# EAGLE board buscard (EAGLE 7.6.0)
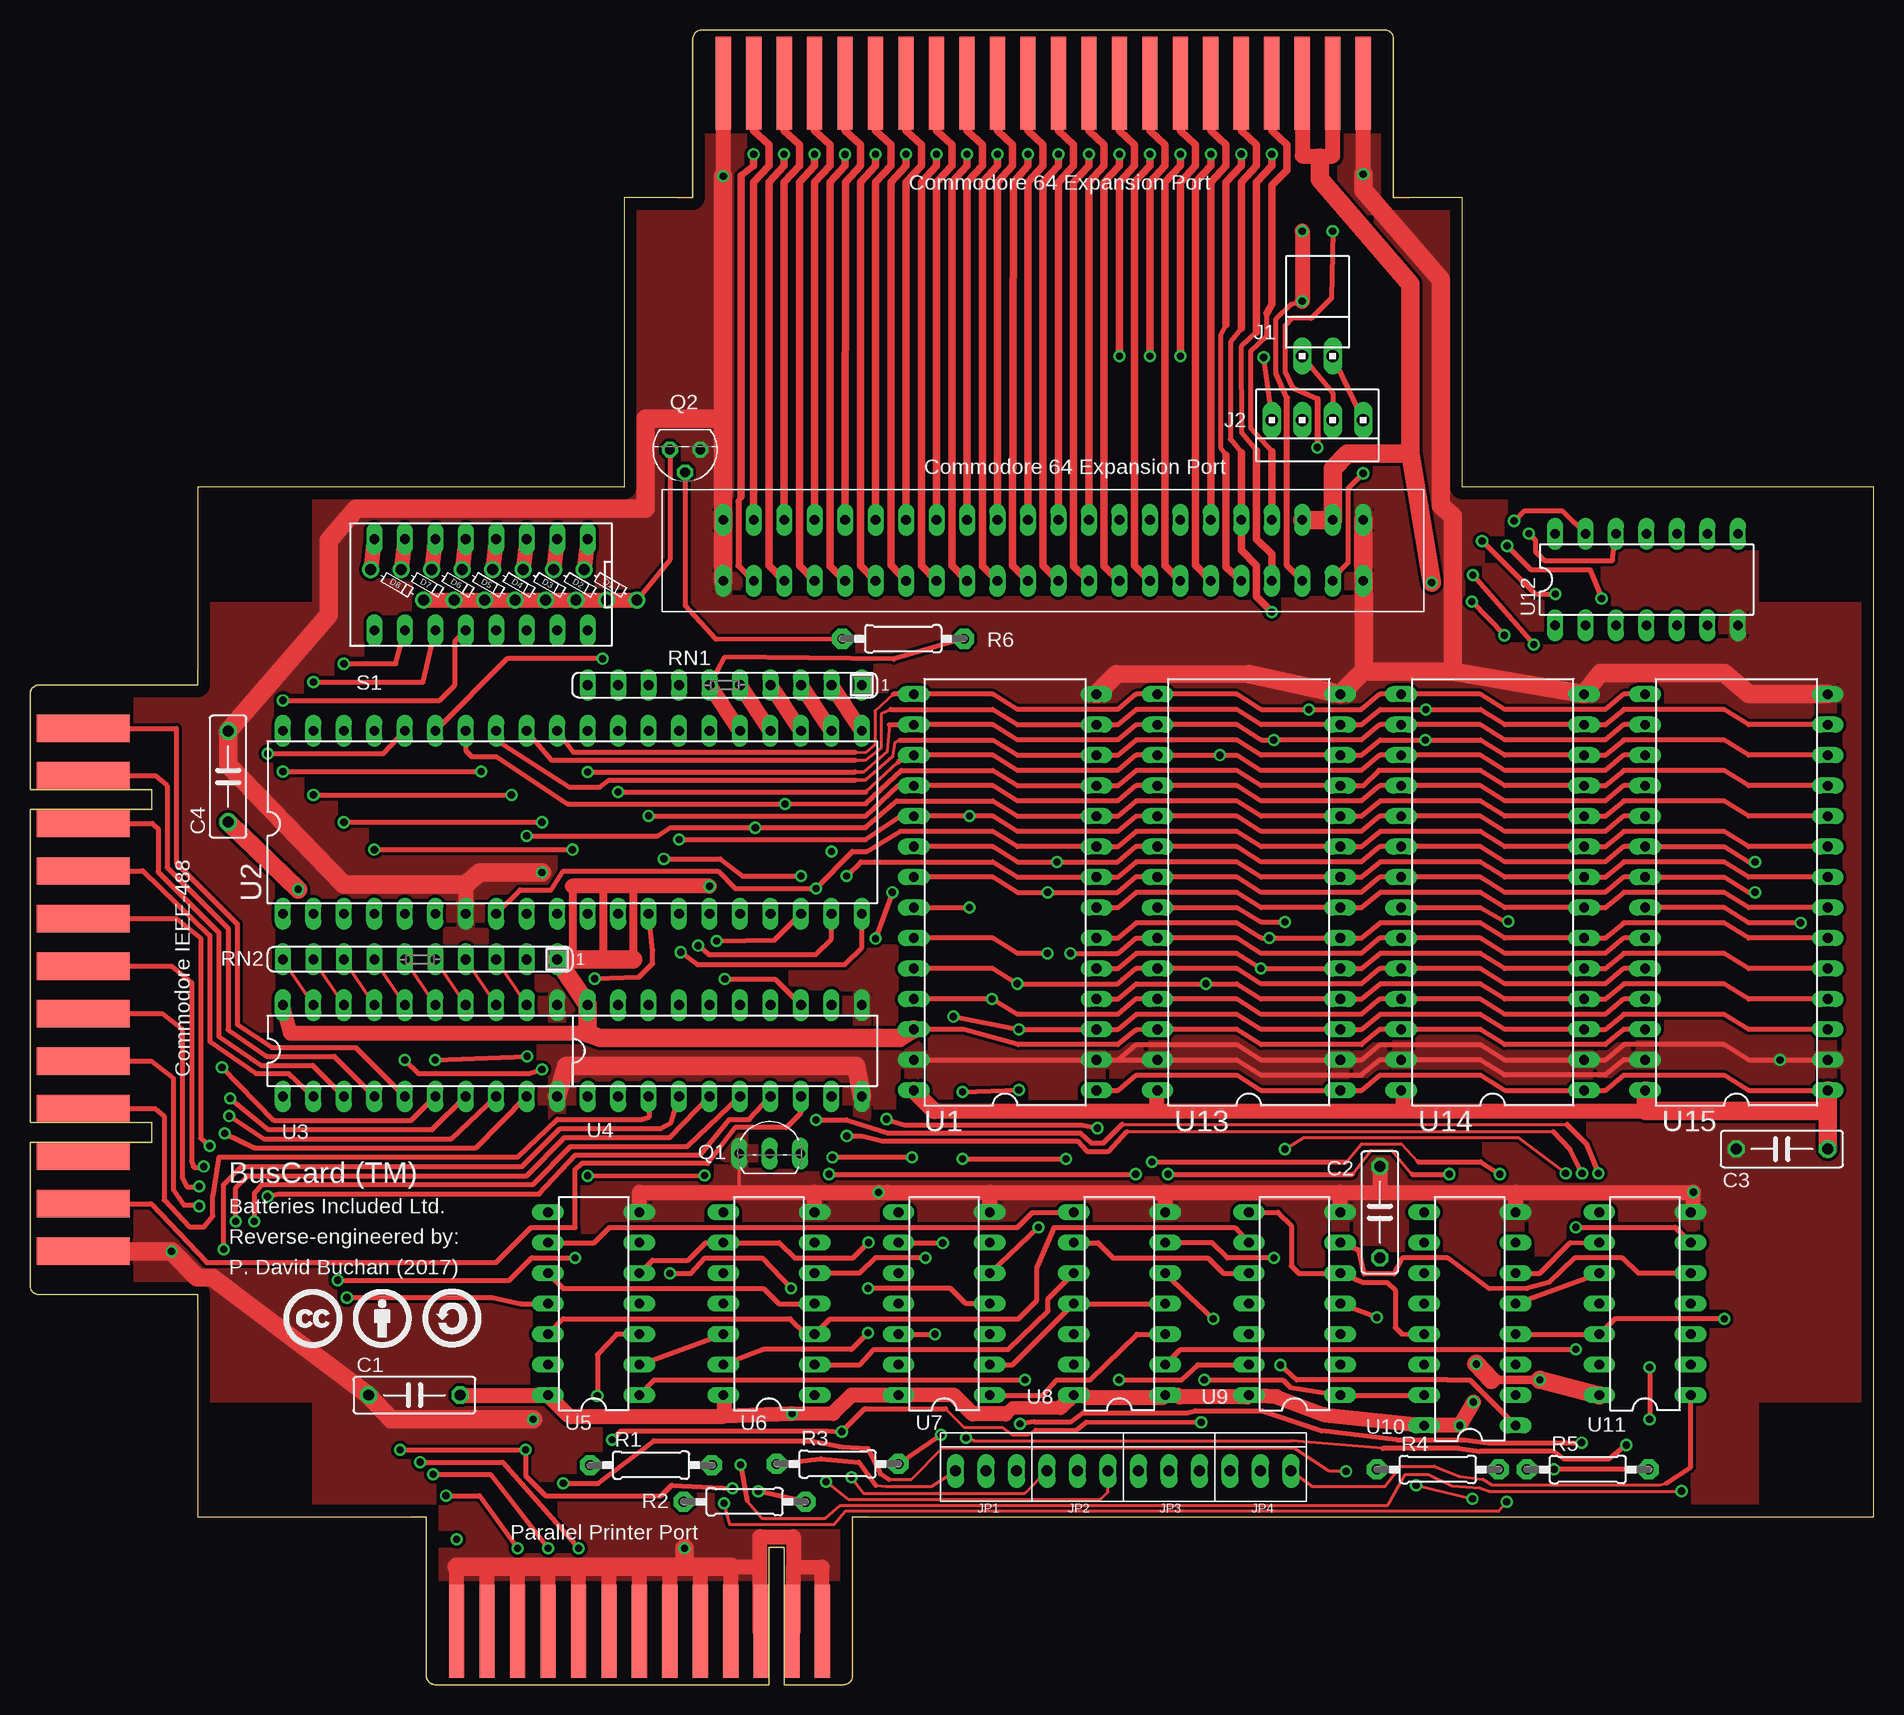
[diagram p5: board, top side]
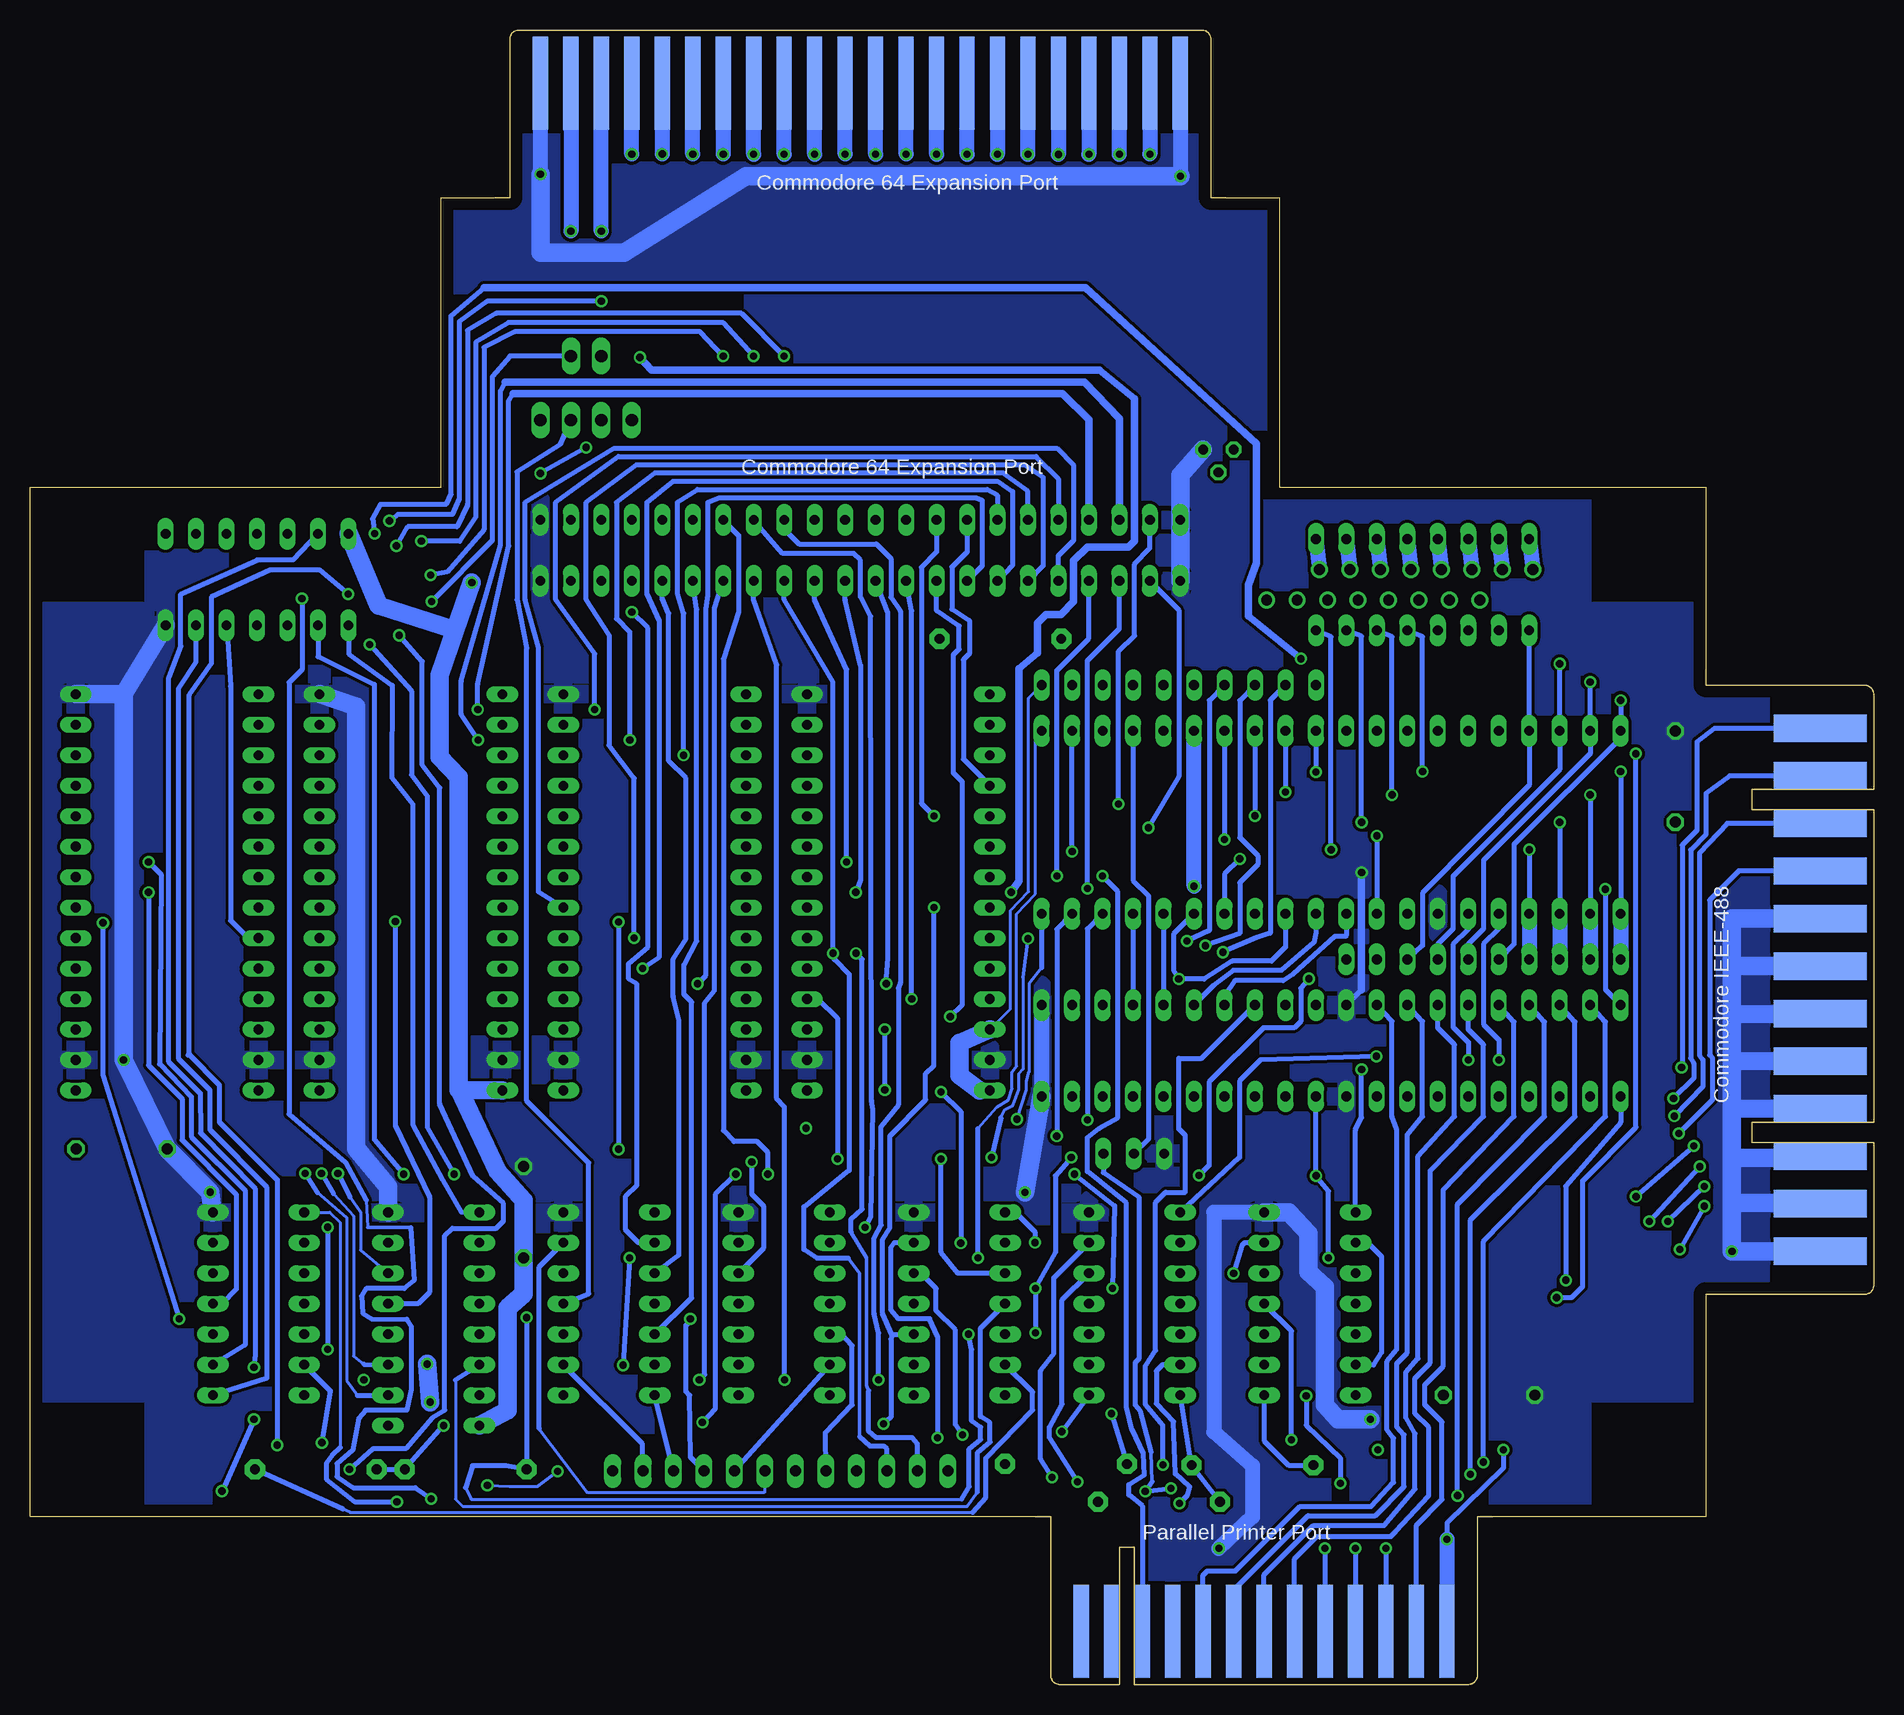
[diagram p6: board, bottom side, seen from below]

Size 153.67 x 137.92 mm. Coordinates in mm from the lower left corner, seen from the top.
Outline: 0,33.27 arc90 0.76,32.51 13.97,32.51 13.97,13.97 33.02,13.97 33.02,0.76 arc90 33.78,0 61.59,0 61.59,11.43 62.87,11.43 62.87,0 67.82,0 arc90 68.58,0.76 68.58,13.97 153.67,13.97 153.67,99.82 119.38,99.82 119.38,123.95 113.67,123.95 113.67,137.16 arc90 112.9,137.92 56.01,137.92 arc90 55.24,137.16 55.24,123.95 49.53,123.95 49.53,99.82 13.97,99.82 13.97,83.31 0.76,83.31 arc90 0,82.55 0,74.6 10.16,74.6 10.16,72.92 0,72.92 0,46.86 10.16,46.86 10.16,45.19 0,45.19 0,33.26
Copper layers (1*16): Top 0.035mm / dielectric 1.5mm / Bottom 0.035mm
Design rules "default *": minimum track width 10mil, minimum drill 23mil, track to track 8mil, track to pad 8mil, pad to pad 8mil, via to via 8mil, smd to smd 8mil, copper to edge 40mil, drill to drill 8mil, minimum pad ring 10mil, minimum via ring 8mil, stop-mask expansion 4mil, vias tented up to drill 0mil, thermal gap 10mil
Net classes: 0 default: width 0.254 mm, drill 0.508 mm, clearance 0.254 mm
tRestrict: area 14,14 to 23.5,23.5; area 14,90.3 to 23.5,99.8; area 144.1,14 to 153.7,23.5; area 144.1,90.3 to 153.7,99.8
bRestrict: area 14,14 to 23.5,23.5; area 14,90.3 to 23.5,99.8; area 144.1,14 to 153.7,23.5; area 144.1,90.3 to 153.7,99.8

## Footprints (pad centres in the part's own frame; a part is rotated, then mirrored left to right if it is on the bottom)
C075-032X103 = drill 0.914 octagon: 1 -3.81,0; 2 3.81,0
DO-1N4148-0.2 = drill 0.9: A -2.54,0; C 2.54,0
10X02MTA = drill 1.016 long: 1 1.27,0; 2 -1.27,0
10X04MTA = drill 1.016 long: 1 3.81,0; 2 1.27,0; 3 -1.27,0; 4 -3.81,0
JUMPER-HEADER-3-POS = drill 0.914 long: 1 2.54,0; 2 0,0; 3 -2.54,0
COMMODORE_64_EXPANSION_PORT_CARD_EDGE = smd 1.27 x 7.747: 1 -26.67,0; 2 -24.13,0; 3 -21.59,0; 4 -19.05,0; 5 -16.51,0; 6 -13.97,0; 7 -11.43,0; 8 -8.89,0; 9 -6.35,0; 10 -3.81,0; 11 -1.27,0; 12 1.27,0; 13 3.81,0; 14 6.35,0; 15 8.89,0; 16 11.43,0; 17 13.97,0; 18 16.51,0; 19 19.05,0; 20 21.59,0; 21 24.13,0; 22 26.67,0 | smd 1.27 x 7.747 bottom: A -26.67,0; B -24.13,0; C -21.59,0; D -19.05,0; E -16.51,0; F -13.97,0; H -11.43,0; J -8.89,0; K -6.35,0; L -3.81,0; M -1.27,0; N 1.27,0; P 3.81,0; R 6.35,0; S 8.89,0; T 11.43,0; U 13.97,0; V 16.51,0; W 19.05,0; X 21.59,0; Y 24.13,0; Z 26.67,0
FEMALE_44-PIN_CARD_EDGE_CONNECTOR = drill 0.813 long: 1 -26.67,-2.54; 2 -24.13,-2.54; 3 -21.59,-2.54; 4 -19.05,-2.54; 5 -16.51,-2.54; 6 -13.97,-2.54; 7 -11.43,-2.54; 8 -8.89,-2.54; 9 -6.35,-2.54; 10 -3.81,-2.54; 11 -1.27,-2.54; 12 1.27,-2.54; 13 3.81,-2.54; 14 6.35,-2.54; 15 8.89,-2.54; 16 11.43,-2.54; 17 13.97,-2.54; 18 16.51,-2.54; 19 19.05,-2.54; 20 21.59,-2.54; 21 24.13,-2.54; 22 26.67,-2.54; A -26.67,2.54; B -24.13,2.54; C -21.59,2.54; D -19.05,2.54; E -16.51,2.54; F -13.97,2.54; H -11.43,2.54; J -8.89,2.54; K -6.35,2.54; L -3.81,2.54; M -1.27,2.54; N 1.27,2.54; P 3.81,2.54; R 6.35,2.54; S 8.89,2.54; T 11.43,2.54; U 13.97,2.54; V 16.51,2.54; W 19.05,2.54; X 21.59,2.54; Y 24.13,2.54; Z 26.67,2.54
COMMODORE_IEEE-488_PORT_CARD_EDGE = smd 2.286 x 7.747: 1 -19.812,0; 2 -15.85,0; 3 -11.887,0; 4 -7.925,0; 5 -3.962,0; 6 0,0; 7 3.962,0; 8 7.925,0; 9 11.887,0; 10 15.85,0; 11 19.812,0; 12 23.774,0 | smd 2.286 x 7.747 bottom: A -19.812,0; B -15.85,0; C -11.887,0; D -7.925,0; E -3.962,0; F 0,0; H 3.962,0; J 7.925,0; K 11.887,0; L 15.85,0; M 19.812,0; N 23.774,0
COMMODORE_PARALLEL_PORT_CARD_EDGE = smd 1.27 x 7.747 bottom: 1 -13.97,0; 3 -11.43,0; 5 -8.89,0; 7 -6.35,0; 9 -3.81,0; 11 -1.27,0; 13 1.27,0; 15 3.81,0; 17 6.35,0; 19 8.89,0; 21 11.43,0; 23 13.97,0; 25 16.51,0 | smd 1.27 x 7.747: 2 -13.97,0; 4 -11.43,0; 6 -8.89,0; 8 -6.35,0; 10 -3.81,0; 12 -1.27,0; 14 1.27,0; 16 3.81,0; 18 6.35,0; 20 8.89,0; 22 11.43,0; 24 13.97,0; 26 16.51,0
TO92-EBC = drill 0.813 long: B 0,-1.27; C 2.54,-1.27; E -2.54,-1.27
TO92 = drill 0.813 octagon: 1 1.27,0; 2 0,1.905; 3 -1.27,0
0207/10 = drill 0.813 pad 1.676 octagon: 1 -5.08,0; 2 5.08,0
SIL10 = drill 0.813 long: 1 -11.43,0; 2 -8.89,0; 3 -6.35,0; 4 -3.81,0; 5 -1.27,0; 6 1.27,0; 7 3.81,0; 8 6.35,0; 9 8.89,0; 10 11.43,0
DS-08 = drill 0.813 long: 1 -8.89,-3.81; 2 -6.35,-3.81; 3 -3.81,-3.81; 4 -1.27,-3.81; 5 1.27,-3.81; 6 3.81,-3.81; 7 6.35,-3.81; 8 8.89,-3.81; 9 8.89,3.81; 10 6.35,3.81; 11 3.81,3.81; 12 1.27,3.81; 13 -1.27,3.81; 14 -3.81,3.81; 15 -6.35,3.81; 16 -8.89,3.81
DIL28 = drill 0.813 long: 1 -16.51,-7.62; 2 -13.97,-7.62; 3 -11.43,-7.62; 4 -8.89,-7.62; 5 -6.35,-7.62; 6 -3.81,-7.62; 7 -1.27,-7.62; 8 1.27,-7.62; 9 3.81,-7.62; 10 6.35,-7.62; 11 8.89,-7.62; 12 11.43,-7.62; 13 13.97,-7.62; 14 16.51,-7.62; 15 16.51,7.62; 16 13.97,7.62; 17 11.43,7.62; 18 8.89,7.62; 19 6.35,7.62; 20 3.81,7.62; 21 1.27,7.62; 22 -1.27,7.62; 23 -3.81,7.62; 24 -6.35,7.62; 25 -8.89,7.62; 26 -11.43,7.62; 27 -13.97,7.62; 28 -16.51,7.62
DIL40 = drill 0.813 long: 1 -24.13,-7.62; 2 -21.59,-7.62; 3 -19.05,-7.62; 4 -16.51,-7.62; 5 -13.97,-7.62; 6 -11.43,-7.62; 7 -8.89,-7.62; 8 -6.35,-7.62; 9 -3.81,-7.62; 10 -1.27,-7.62; 11 1.27,-7.62; 12 3.81,-7.62; 13 6.35,-7.62; 14 8.89,-7.62; 15 11.43,-7.62; 16 13.97,-7.62; 17 16.51,-7.62; 18 19.05,-7.62; 19 21.59,-7.62; 20 24.13,-7.62; 21 24.13,7.62; 22 21.59,7.62; 23 19.05,7.62; 24 16.51,7.62; 25 13.97,7.62; 26 11.43,7.62; 27 8.89,7.62; 28 6.35,7.62; 29 3.81,7.62; 30 1.27,7.62; 31 -1.27,7.62; 32 -3.81,7.62; 33 -6.35,7.62; 34 -8.89,7.62; 35 -11.43,7.62; 36 -13.97,7.62; 37 -16.51,7.62; 38 -19.05,7.62; 39 -21.59,7.62; 40 -24.13,7.62
DIL20 = drill 0.813 long: 1 -11.43,-3.81; 2 -8.89,-3.81; 3 -6.35,-3.81; 4 -3.81,-3.81; 5 -1.27,-3.81; 6 1.27,-3.81; 7 3.81,-3.81; 8 6.35,-3.81; 9 8.89,-3.81; 10 11.43,-3.81; 11 11.43,3.81; 12 8.89,3.81; 13 6.35,3.81; 14 3.81,3.81; 15 1.27,3.81; 16 -1.27,3.81; 17 -3.81,3.81; 18 -6.35,3.81; 19 -8.89,3.81; 20 -11.43,3.81
DIL14 = drill 0.813 long: 1 -7.62,-3.81; 2 -5.08,-3.81; 3 -2.54,-3.81; 4 0,-3.81; 5 2.54,-3.81; 6 5.08,-3.81; 7 7.62,-3.81; 8 7.62,3.81; 9 5.08,3.81; 10 2.54,3.81; 11 0,3.81; 12 -2.54,3.81; 13 -5.08,3.81; 14 -7.62,3.81
DIL16 = drill 0.813 long: 1 -8.89,-3.81; 2 -6.35,-3.81; 3 -3.81,-3.81; 4 -1.27,-3.81; 5 1.27,-3.81; 6 3.81,-3.81; 7 6.35,-3.81; 8 8.89,-3.81; 9 8.89,3.81; 10 6.35,3.81; 11 3.81,3.81; 12 1.27,3.81; 13 -1.27,3.81; 14 -3.81,3.81; 15 -6.35,3.81; 16 -8.89,3.81

## Placement (x,y rotation side)
C1  0.1 uF  [C075-032X103]  32.04,24.13 0 top
C2  0.1 uF  [C075-032X103]  112.52,39.37 90 top
C3  0.1 uF  [C075-032X103]  146.02,44.63 180 top
C4  0.1 uF  [C075-032X103]  16.51,75.69 90 top
D1  1N4148  [DO-1N4148-0.2]  48.39,91.68 330 top
D2  1N4148  [DO-1N4148-0.2]  45.85,91.68 330 top
D3  1N4148  [DO-1N4148-0.2]  43.31,91.68 330 top
D4  1N4148  [DO-1N4148-0.2]  40.77,91.68 330 top
D5  1N4148  [DO-1N4148-0.2]  38.23,91.68 330 top
D6  1N4148  [DO-1N4148-0.2]  35.69,91.68 330 top
D7  1N4148  [DO-1N4148-0.2]  33.15,91.68 330 top
D8  1N4148  [DO-1N4148-0.2]  30.61,91.68 330 top
J1  [10X02MTA]  107.31,110.74 180 top
J2  [10X04MTA]  107.31,105.41 180 top
JP1  [JUMPER-HEADER-3-POS]  79.71,17.81 0 top
JP2  [JUMPER-HEADER-3-POS]  87.33,17.81 0 top
JP3  [JUMPER-HEADER-3-POS]  94.95,17.81 0 top
JP4  [JUMPER-HEADER-3-POS]  102.57,17.81 0 top
P1  COMMODORE_64_EXPANSION_PORT_CARD_EDGE  [COMMODORE_64_EXPANSION_PORT_CARD_EDGE]  84.45,133.48 180 top
P2  FEMALE_44-PIN_CARD_EDGE_CONNECTOR  [FEMALE_44-PIN_CARD_EDGE_CONNECTOR]  84.45,94.54 180 top
P3  COMMODORE_IEEE-488_PORT_CARD_EDGE  [COMMODORE_IEEE-488_PORT_CARD_EDGE]  4.45,59.89 270 top
P4  Parallel Port  [COMMODORE_PARALLEL_PORT_CARD_EDGE]  49.53,4.45 0 top
Q1  2N4401  [TO92-EBC]  61.66,45.53 0 top
Q2  2N3904  [TO92]  54.61,102.95 180 top
R1  4.7 k  [0207/10]  51.77,18.29 0 top
R2  1.5 k  [0207/10]  59.56,15.24 0 top
R3  4.7 k  [0207/10]  67.31,18.39 0 top
R4  4.7 k  [0207/10]  117.35,17.93 0 top
R5  4.7 k  [0207/10]  129.84,17.93 0 top
R6  1 k  [0207/10]  72.78,87.17 180 top
RN1  4.67 k  [SIL10]  57.91,83.31 180 top
RN2  4.67 k  [SIL10]  32.51,60.45 180 top
S1  DIP Switch  [DS-08]  37.59,91.68 180 top
U1  TMS 2564  [DIL28]  81.28,66.04 90 top
U2  8255AC-5  [DIL40]  45.21,71.88 0 top
U3  75160AN  [DIL20]  32.51,52.83 0 top
U4  75161AN  [DIL20]  57.91,52.83 0 top
U5  74LS32N  [DIL14]  46.99,31.75 90 top
U6  74LS04N  [DIL14]  61.59,31.75 90 top
U7  74LS08N  [DIL14]  76.2,31.75 90 top
U8  74LS00N  [DIL14]  90.81,31.75 90 top
U9  74LS21N  [DIL14]  105.41,31.75 90 top
U10  74LS139N  [DIL16]  120.02,30.48 90 top
U11  74LS21N  [DIL14]  134.62,31.75 90 top
U12  74LS04N  [DIL14]  134.75,92.11 0 top
U13  TMS 2564  [DIL28]  101.6,66.04 90 top
U14  TMS 2564  [DIL28]  121.92,66.04 90 top
U15  TMS 2564  [DIL28]  142.24,66.04 90 top

## Tracks (layer width: path | path; a pad name or v marks a point on that pad's centre or on a via)
!CS  (via drill 0.6)
  Top 0.406: v33.78,52.07 v41.44,52.38
  Bottom 0.406: v41.44,52.38 51.09,52.07 52.84,50.32 52.84,43.94 U6.8 | U2.6 33.78,62.94 35.05,61.68 35.05,54.8 33.77,53.53 v33.78,52.07
!DMA
  Top 0.406: P1.13 80.64,129.54
  Top 0.61: 80.64,129.54 81.92,128.37 81.92,126.62 80.63,125.22 P2.13
!IRQ
  Top 0.406: P1.4 103.5,129.54 | 103.5,102.77 101.74,104.75 101.74,111.14 103.12,112.46 103.12,114.3
  Top 0.61: 103.5,129.54 104.78,128.37 104.78,126.24 103.5,124.97 103.5,115.06 103.12,114.3 | 103.5,102.77 P2.4
!NMI  (via drill 0.6)
  Top 0.406: 102.23,112.75 100.95,111.52 100.99,104.34 102.23,102.87
  Top 0.61: v103.5,127.57 103.5,126.62 102.23,125.22 102.23,112.75 | 102.23,102.87 102.23,95.5 103.5,94.23 P2.D
  Bottom 1.27: v103.5,127.57 P1.D
!RD  (via drill 0.6)
  Top 0.406: v31.24,52.07 32.38,50.93 41.62,50.93 v42.67,51.27
  Bottom 0.406: U2.5 31.24,62.99 32.51,61.72 32.51,55.03 31.23,53.75 v31.24,52.07 | U5.8 43.18,46.23 42.67,47.27 v42.67,51.27
!RESET  (via drill 0.6)
  Top 0.254: 59.78,15.33 61.02,13.84 66.29,13.84 67.56,14.94 113.17,14.94 114.63,17.51 116.57,17.51 118.5,16.55 120.84,16.42 121.64,16.13 v137.67,16.13
  Top 0.406: v135,26.45 v135,22.1 | v59.22,18.31 59.78,15.33 | U12.13 127.79,97.8 124.51,97.8 v123.71,97 | 104.78,107.24 103.87,109.32 103.87,113.84 105.09,115.06 v106.05,115.32
  Top 0.508: P2.C 104.78,93.27 104.78,107.24
  Top 1.27: v106.05,121.16 v106.05,115.32
  Bottom 0.406: v135,26.45 134.86,27.55 134.86,41.3 139.45,45.97 139.47,49.29 142.09,51.91 142.09,83.96 141.1,86.59 141.1,90.88 134.75,93.75 131.75,93.75 U12.13 | v135,22.1 v137.67,16.13 | v59.22,18.31 59.24,21.63 60.71,23.37 60.71,26.56 59.85,27.85 59.85,40.18 59,41.03 57.37,41.03 57.37,45.78 57.9,46.32 57.9,52.2 56.01,52.2 U4.18 | v106.05,115.32 115.57,115.32 117.88,113.61 117.88,98.86 118.48,97.54 123,97.54 v123.71,97
  Bottom 1.27: v106.05,121.16 P1.C
!ROMH  (via drill 0.6)
  Top 0.406: v108.58,121.16 108.48,115.57 106.79,113.88 105.21,113.88 104.61,113.28 104.61,109.44 105.25,108.1 107.31,107.19 | v111.12,100.97 109.86,99.71 109.86,93.52 108.58,92.24 P2.B
  Top 0.508: 107.31,107.19 v107.31,103.12
  Bottom 0.406: 108.58,129.69 108.5,133.39 P1.B | v107.31,103.12 v111.12,100.97
  Bottom 1.27: 108.58,129.69 v108.58,121.16
!ROML
  Top 0.406: P1.11 85.72,129.54
  Top 0.61: 85.72,129.54 87,128.37 87,126.62 85.74,125.22 P2.11
!WR  (via drill 0.6)
  Top 0.406: v26.42,32.26 38.53,32.26 40.95,31.74 43.17,31.74 U5.11 | v19.81,77.6 29.46,77.6 U2.36
  Bottom 0.406: v26.42,32.26 25.16,32.26 24.24,33.17 24.24,41.99 19.81,46.44 v19.81,77.6
A0  (via drill 0.6)
  Top 0.406: U15.10 143.26,72.39 141.22,73.66 132.84,73.66 131.32,72.39 U14.10 122.94,72.39 120.9,73.66 112.52,73.66 111,72.39 U13.10 102.62,72.39 100.58,73.66 92.2,73.66 90.68,72.39 U1.10 82.3,72.39 80.26,73.66 72.26,73.66 69.65,71.42 v60.45,71.42 53.39,71.42 52.32,70.75 v41.4,70.75
  Top 0.508: 59.28,99.02 59.05,98.64 59.05,93.26 P2.Y
  Top 0.61: v60.33,127.57 60.33,126.62 59.28,125.75 59.28,99.02
  Bottom 0.406: v41.4,70.75 U2.9 | P2.Y 57.91,89.56 57.91,75.69 v60.45,71.42
  Bottom 1.27: P1.Y v60.33,127.57
A1  (via drill 0.6)
  Top 0.406: U15.9 143.26,69.85 141.22,71.12 132.84,71.12 131.32,69.85 U14.9 122.94,69.85 120.9,71.12 112.52,71.12 111,69.85 U13.9 102.62,69.85 100.58,71.12 92.2,71.12 90.68,69.85 U1.9 82.3,69.85 80.26,71.12 72.53,71.12 69.76,69.44 68.54,69.44 v65.53,66.36 58.79,66.36 57.34,67.81 44.45,67.81 43.43,66.24 40.84,66.24 U2.8
  Top 0.61: v62.87,127.56 62.87,126.62 61.59,125.22 61.59,93.28 P2.X
  Bottom 0.406: v65.53,66.36 65.53,85.34 62.87,88.01 P2.X
  Bottom 1.27: v62.87,127.56 P1.X
A2  (via drill 0.6)
  Top 0.406: U15.8 143.26,67.31 141.22,68.58 132.84,68.58 131.32,67.31 U14.8 122.94,67.31 120.9,68.58 112.52,68.58 111,67.31 U13.8 102.62,67.31 100.58,68.58 92.2,68.58 90.68,67.31 U1.8 82.3,67.31 80.26,68.58 69.25,68.58 v68.07,67.4
  Top 0.61: v65.41,127.56 65.41,126.62 64.14,125.22 64.14,93.29 P2.W
  Bottom 0.406: v68.07,67.4 68.07,84.54 65.41,87.2 P2.W
  Bottom 1.27: P1.W v65.41,127.56
A3  (via drill 0.6)
  Top 0.406: U15.7 143.26,64.77 141.22,66.04 132.84,66.04 131.32,64.77 U14.7 122.94,64.77 120.9,66.04 112.52,66.04 111,64.77 U13.7 102.62,64.77 100.58,66.04 92.2,66.04 90.68,64.77 U1.7
  Top 0.61: v67.94,127.55 67.94,126.62 66.67,125.22 66.67,93.23 P2.V
  Bottom 0.406: U13.7 111.28,66.08 111.28,86.46 112.39,90.42 112.39,98.55 104.97,103.05 68.07,103.05 66.67,101.65 66.67,95.38 67.94,94.11 P2.V
  Bottom 1.27: P1.V v67.94,127.55
A4  (via drill 0.6)
  Top 0.406: U15.6 143.26,62.23 141.22,63.5 132.84,63.5 131.32,62.23 U14.6 122.94,62.23 120.9,63.49 112.52,63.5 111,62.23 U13.6 v103.31,62.23 102.62,62.24 100.58,63.5 92.2,63.5 90.68,62.23 U1.6
  Top 0.61: v70.48,127.56 70.48,126.62 69.22,125.22 69.22,93.29 P2.U
  Bottom 0.406: v103.31,62.23 103.31,75.53 105.41,78.3 105.41,87.5 107.31,90.42 107.31,98.55 103.12,101.68 70.79,101.68 69.22,100.65 69.22,93.27 P2.U
  Bottom 1.27: v70.48,127.56 P1.U
A5  (via drill 0.6)
  Top 0.406: U15.5 143.26,59.69 141.22,60.96 132.84,60.96 131.32,59.69 U14.5 122.94,59.69 120.9,60.96 112.52,60.96 111,59.69 U13.5 v102.62,59.69 100.58,60.96 92.2,60.96 90.68,59.69 U1.5
  Top 0.61: v73.03,127.56 73.03,126.62 71.75,125.22 71.75,93.32 P2.T
  Bottom 0.406: v102.62,59.69 101.21,60.66 101.21,88.65 102.23,90.93 102.23,98.55 100.08,100.31 73.03,100.31 71.75,99.45 71.75,93.32 P2.T
  Bottom 1.27: P1.T v73.03,127.56
A6  (via drill 0.6)
  Top 0.406: U15.4 143.26,57.15 141.22,58.42 132.84,58.42 131.32,57.15 U14.4 122.94,57.15 120.9,58.42 112.52,58.42 111,57.15 U13.4 102.62,57.15 100.58,58.42 v98.03,58.42 92.2,58.42 90.68,57.15 U1.4 | v77.72,43.81 v86.36,43.81
  Top 0.61: P2.S 74.3,93.29 74.3,125.22 75.56,126.62 v75.56,127.56
  Bottom 0.406: U7.10 76.33,34.29 77.72,36.04 v77.72,43.81 | v98.03,58.42 97.33,59.12 97.33,89.66 97.16,90.81 97.16,98.55 96.19,98.93 74.83,98.93 74.31,98.73 74.31,93.25 P2.S | U1.4 87.97,57.15 86.36,55.56 v86.36,43.81
  Bottom 1.27: v75.56,127.56 P1.S
A7  (via drill 0.6)
  Top 0.406: U15.3 143.26,54.61 141.22,55.88 132.84,55.88 131.32,54.61 U14.3 122.94,54.61 120.9,55.88 112.52,55.88 111,54.61 U13.3 102.62,54.61 100.58,55.88 92.2,55.88 90.68,54.61 U1.3 v82.42,54.61 v76.96,55.68 | v77.72,49.4 v82.42,49.57 | U7.9 v76.09,36.8
  Top 0.61: v78.11,127.56 78.11,126.62 76.86,125.22 76.83,93.26 P2.R
  Bottom 0.406: v76.96,55.68 75.95,56.69 75.95,75.25 76.69,76 76.69,85.84 76.22,86.31 76.22,88.24 78.11,89.51 P2.R | v82.42,54.61 v82.42,49.57 | v77.72,49.4 76.09,47.77 v76.09,36.8
  Bottom 1.27: v78.11,127.56 P1.R
A8  (via drill 0.6)
  Top 0.406: U15.25 132.84,57.15 131.32,55.88 122.94,55.88 120.9,57.15 U14.25 112.52,57.15 111,55.88 102.62,55.88 100.58,57.15 U13.25 92.2,57.16 90.68,55.88 82.3,55.88 v80.17,57.15 U1.25
  Top 0.61: v80.64,127.57 80.64,126.62 79.41,125.22 79.38,93.23 P2.P
  Bottom 0.406: v80.17,57.15 80.17,89.51 P2.P
  Bottom 1.27: v80.64,127.57 P1.P
A9  (via drill 0.6)
  Top 0.406: U15.24 132.84,59.69 131.32,58.42 122.94,58.42 120.9,59.69 U14.24 112.52,59.69 111,58.42 102.62,58.42 100.58,59.69 U13.24 92.2,59.68 90.68,58.42 v82.3,58.42 80.26,59.69 U1.24
  Top 0.61: v83.19,127.56 83.19,126.62 81.99,125.22 81.92,93.26 P2.N
  Bottom 0.406: v82.3,58.42 82.17,60.55 82.17,89.33 P2.N
  Bottom 1.27: v83.19,127.56 P1.N
A10  (via drill 0.6)
  Top 0.406: U1.21 80.26,67.31 82.3,66.04 v84.84,66.04 90.68,66.04 92.2,67.32 U13.21 100.58,67.31 102.62,66.04 111,66.04 112.52,67.31 U14.21 120.9,67.31 122.94,66.04 131.32,66.04 132.84,67.31 U15.21 141.22,67.31 143.26,66.04 v143.79,66.04
  Top 0.61: v85.72,127.57 85.72,126.62 84.45,125.22 84.45,93.27 P2.M
  Bottom 0.406: v143.79,66.04 143.79,51.61 141,48.82 141,45.39 136.47,40.86 136.47,32.98 137.71,31.75 U11.4 | P2.M 85.72,90.42 84.43,84.96 84.43,67.06 v84.84,66.04
  Bottom 1.27: v85.72,127.57 P1.M
A11  (via drill 0.6)
  Top 0.406: U1.20 80.26,69.85 82.3,68.58 v85.6,68.58 90.68,68.58 92.2,69.86 U13.20 100.58,69.85 102.62,68.58 111,68.58 112.52,69.85 U14.20 120.9,69.85 122.94,68.58 131.32,68.58 132.84,69.85 U15.20 141.22,69.85 143.26,68.58 v143.79,68.58
  Top 0.61: v88.27,127.56 88.27,126.62 87,125.22 87,93.22 P2.L
  Bottom 0.406: v143.79,68.58 142.75,67.54 142.86,51.73 140.22,49 140.22,45.67 135.74,41.2 135.74,28.31 U11.2 | v85.6,68.58 85.6,84.62 88.27,90.42 P2.L
  Bottom 1.27: v88.27,127.56 P1.L
A12  (via drill 0.6)
  Top 0.406: U15.23 132.84,62.23 131.32,60.96 122.94,60.96 120.9,62.23 U14.23 112.52,62.23 111,60.96 102.62,60.96 100.58,62.23 U13.23 92.2,62.23 90.68,60.96 v86.74,60.96
  Top 0.61: P2.K 89.53,93.22 89.53,125.22 90.81,126.62 v90.81,127.56
  Bottom 0.305: 84.51,20.66 84.51,34.29 85.47,35.56
  Bottom 0.406: U15.23 135.48,62.23 136.94,63.69 136.94,83.22 U12.5 | JP1.1 82.25,19.63 82.49,19.88 83.66,19.88 84.51,20.66 | 85.47,35.56 88.09,35.56 89.17,36.26 89.17,39.83 85.38,42.9 | 85.38,42.9 85.38,59.21 86.61,60.44 v86.74,60.96 86.74,83.57 90.81,90.42 P2.K | 85.38,42.9 85.38,42.82
  Bottom 1.27: v90.81,127.56 P1.K
A13  (via drill 0.6)
  Top 0.406: v90.78,25.4 95.99,25.4 97.35,26.67 U9.13
  Top 0.61: v93.34,127.56 93.34,126.62 92.08,125.22 92.08,93.28 P2.J
  Bottom 0.406: v90.78,25.4 90.78,48.17 91.44,48.86 91.44,85.01 93.37,90.42 P2.J
  Bottom 1.27: v93.34,127.56 P1.J
A14  (via drill 0.6)
  Top 0.406: U10.15 U9.1 105.05,24.78 104.43,25.4 v97.88,25.4
  Top 0.61: v95.89,127.57 95.89,126.62 94.61,125.22 94.61,93.27 P2.H
  Bottom 0.406: v97.88,25.4 97.42,25.86 97.42,56.83 96.62,57.85 96.62,89.74 P2.H
  Bottom 1.27: P1.H v95.89,127.57
A15  (via drill 0.6)
  Top 0.61: v98.42,127.57 98.42,126.62 97.16,125.22 97.16,93.32 P2.F
  Bottom 0.406: U9.12 98.51,32.23 98.51,56.9 99.16,57.54 99.16,59.99 98.09,61.98 98.09,89.65 P2.F
  Bottom 1.27: v98.42,127.57 P1.F
ATN
  Top 0.406: P3.11 10.08,40.08 14.72,35.18 38.85,35.18 41.77,38.1 45.45,38.1 45.43,42.93 45.96,43.43 56.49,43.43 58.79,46.43 63.06,46.43 64.26,47.64 U4.8
BA
  Top 0.406: P1.12 83.19,129.54
  Top 0.61: 83.19,129.54 84.45,128.37 84.45,126.62 83.2,125.22 P2.12
BC-!EXROM  (via drill 0.6)
  Top 0.406: U5.1 52.06,25.4 v82.93,25.4
  Bottom 0.406: P2.9 90.81,96.33 89.56,95.08 83.12,95.08 81.92,93.87 81.92,90.64 81.13,89.48 81.13,58.51 81.28,58.05 81.28,48.32 82.73,46.55 82.73,38.32 83.31,37.25 83.31,30.92 82.93,29.3 v82.93,25.4 | U5.1 50.8,20.33 48.76,18.29 R1.1
BC-!GAME  (via drill 0.6)
  Top 0.406: R3.2 v75.95,20.83 | v84.07,38.1 U7.5
  Bottom 0.406: v75.95,20.83 76.54,21.68 76.54,29.55 78.13,31.14 78.13,33.01 79.41,34.29 U7.5 | v84.07,38.1 83.57,39.01 83.41,47.95 83.52,48.67 83.59,89.03 84.45,90.68 84.45,93.73 85.01,94.28 90.93,94.28 P2.8
BC-I/O1  (via drill 0.6)
  Top 0.406: v53.34,34.27 55.09,34.27 56.26,35.56 61.04,35.56 v63.44,33.03 | v66.6,42.55 v92.16,42.55
  Bottom 0.406: U5.6 52.44,36.83 52.64,36.63 v53.34,34.27 | P2.7 94.6,95.8 94.6,89.41 95.86,85.5 95.86,46.18 95,45.26 93.05,45.26 92.16,44.35 v92.16,42.55 | v66.6,42.55 63.26,39.9 v63.44,33.03
BC-ROM-INACTIVE  (via drill 0.6)
  Top 0.254: v123.09,15.24 122.4,14.43 67.97,14.43 67.03,13.34 58.34,13.34 v57.86,15.11
  Top 0.406: U7.4 78.04,31.75 76.73,33.02 v69.85,33.02 | v69.85,29.31 68.48,27.94 61.12,27.94 U6.13 | v73.53,43.94 v66.88,43.94 | v71.88,66.04 v70.48,62.18 | v102.83,110.63 J2.1
  Bottom 0.254: 70.89,58.93 70.89,51.31 71.25,50.93 71.25,49.59 71.74,48.26 72.39,47.93 72.73,47.26 | U11.8 128.68,39.37 127.81,38.51 127.81,19.74
  Bottom 0.305: 70.89,58.93 v70.48,62.18
  Bottom 0.406: U6.13 59.27,26.67 59.79,26.15 59.79,23.42 58.36,21.91 58.19,17.56 57.02,16.5 57.23,15.75 v57.86,15.11 | v69.85,29.31 v69.85,33.02 68.2,35.99 68.2,42.42 v66.88,43.94 | 72.73,47.26 v73.53,43.94 | 127.81,19.74 128.46,19.16 128.98,18.43 128.98,17.12 126.62,15.24 v123.09,15.24
  Bottom 0.61: v71.88,66.04 71.25,66.98 71.25,84.71 69.67,85.98 69.67,88.49 68.97,89.19 67.72,89.19 66.67,90.26 66.67,93.7 65.55,94.81 62.1,94.81 61.59,95.31 61.59,107.19 64.52,109.55 101.85,109.55 v102.83,110.63
BUSY  (via drill 0.6)
  Top 0.406: v52.83,68.83 57.53,68.83 59.38,67.4 v64.26,67.4
  Bottom 0.406: v64.26,67.4 62.99,66.1 62.99,47.24 64.55,46.35 65.53,45.59 65.53,42.77 62.29,40.13 62.29,23.15 61.84,21.25 60.9,19.29 60.81,17.45 62.08,16.66 62.08,15.8 60.96,14.9 P4.21 | v52.83,68.83 54.1,67.56 U2.14
C64-!EXROM  (via drill 0.6)
  Top 0.254: v115.55,16.6 v120.24,15.48 | v109.7,17.78 108.33,17.78 105.41,19.68 76.01,19.68 73.44,17.07 71.63,17.07
  Top 0.406: P1.9 90.81,129.54 | v44.45,16.76 47.36,16.76 52.02,20.32 65.14,20.32 67.69,19.81 69.86,19.68 70.89,17.55 71.63,17.07 | U5.3 48.88,29.21 47.3,27.52 v47.3,24.08 | v123.13,94.92 125.12,92.93 130.02,92.93 v131,90.54
  Top 0.61: 90.81,129.54 92.08,128.37 92.08,126.62 90.81,125.22 v90.81,110.74
  Bottom 0.254: v115.55,16.6 113.7,16.51 111.34,16.51 | 125.63,40.4 125.54,38.1
  Bottom 0.305: v109.7,17.78 111.34,16.51 | 125.54,38.1 121.92,38.1
  Bottom 0.406: v90.81,110.74 94.36,114.3 114.81,114.3 117.2,112.89 117.2,98.37 118.08,96.52 122.17,96.52 v123.13,94.92 | v47.3,24.08 47.3,21.61 44.45,18.89 v44.45,16.76 | v131,90.54 131,84.61 132.08,83.53 132.08,47.55 127.37,43.51 125.63,40.4 | 121.92,38.1 121.65,33.68 122.47,33.02 125.64,33.02 126.03,32.38 125.93,30.96 125.17,30.48 122.26,30.45 121.89,29.84 121.89,24.62 122.26,22.86 125.69,22.86 126.26,22.21 126.78,19.52 128.07,18.4 128.07,17.34 126.75,16.41 121.56,16.41 v120.24,15.48
C64-!GAME  (via drill 0.6)
  Top 0.254: 112.76,19.68 105.16,20.32 78.74,20.32
  Top 0.305: 78.74,20.32 v78.03,20.57
  Top 0.406: P1.8 93.34,129.54 | v133.06,19.96 131.6,18.8 127.88,18.8 127.04,19.43 120.85,19.43 119.11,19.68 112.76,19.68 | v121.04,95.31 125.46,90.89 v127.14,90.89
  Top 0.61: 93.34,129.54 94.61,128.37 94.61,126.62 93.34,125.22 v93.34,110.74
  Bottom 0.406: v121.04,95.31 117.86,95.31 116.51,97.33 116.51,111.9 113.79,113.54 95.91,113.54 v93.34,110.74 | U7.6 80.03,36.85 81.61,36.85 81.92,36.42 81.92,31.25 81.28,30.49 78.69,30.49 78.03,29.01 v78.03,20.57 | v127.14,90.89 129.53,92.91 133.64,92.91 138.56,90.64 138.56,85.11 140.39,82.53 140.39,52.58 140.49,52.48 140.37,52.48 137.86,49.96 137.86,46.88 133.06,42.08 v133.06,19.96
C64-I/O1  (via drill 0.6)
  Top 0.254: 76.31,22.99 77.84,21.46 81,21.46 81.86,20.83 83.19,20.83 83.83,21.21 | 110.24,42.55 111.76,44.53 113.54,44.53 115.19,42.55
  Top 0.406: P1.7 95.89,129.54 | v48.51,20.4 49.26,21.14 66.45,21.14 v67.67,21.08 69.57,22.99 76.31,22.99 | 83.83,21.21 87.2,21.21 88.06,21.88 v97.62,21.86 | v94.84,42.55 110.24,42.55 | 115.19,42.55 v118.31,42.55 | v120.28,92.49 v125.36,86.69
  Top 0.61: 95.89,129.54 97.16,128.37 97.16,126.62 95.89,125.22 v95.89,110.74
  Bottom 0.406: v95.89,110.74 97.81,112.78 113.28,112.78 115.82,111.48 115.82,96.29 118.91,92.73 v120.28,92.49 | U6.1 v67.67,21.08 | v48.51,20.4 48.51,29.46 U5.4 | v125.36,86.69 121.87,82.8 121.87,75.83 120.55,74.05 120.55,46.46 v118.31,42.55 | v94.84,42.55 96.55,40.84 96.55,22.99 v97.62,21.86
CLIP1  (via drill 0.6)
  Top 0.406: v120.19,90.27 v122.9,87.47 | R5.2 v127.04,17.93 | J2.4 J1.2
  Bottom 0.254: 75.08,14.35 127,14.35 127.57,14.62
  Bottom 0.406: 75.08,14.35 74,15.57 74,18.87 70.1,22.86 70.1,24.38 U7.13 | v127.04,17.93 125.06,19.68 122.33,19.68 120.14,22.23 119.09,22.86 119.09,37.43 118.48,38.04 114.81,38.04 114.21,38.63 114.21,40.11 116.73,42.34 119.51,48.41 119.51,74.74 120.98,76.64 120.98,85.28 v122.9,87.47 | v120.19,90.27 115.14,95.38 115.14,109.02 113.65,110.74 J1.2 | 127.57,14.62 R5.2
CLIP2  (via drill 0.6)
  Top 0.406: v112.27,30.59 U9.4 | U7.12 v75.44,29.21 | J1.1 108.58,107.71 J2.3
  Bottom 0.254: 76.01,15.44 116.9,15.44 117.37,16.41
  Bottom 0.406: 76.01,15.44 75.39,16.5 75.39,19.63 74.42,20.43 74.42,21.46 75.18,21.97 75.18,27.94 v75.44,29.21 | 117.37,16.41 116.78,18.25 114.01,18.25 R4.1 v112.27,30.59 | U9.4 107.1,32.59 107.1,43.5 112.25,48.65 112.25,86.36 113.08,90.42 113.08,101.09 109.44,103.4 J2.3
D0  (via drill 0.6)
  Top 0.406: P1.21 60.33,129.54 | U15.11 143.26,74.93 141.22,76.2 132.84,76.2 131.32,74.93 U14.11 122.94,74.93 120.9,76.2 112.42,76.2 111.15,74.93 U13.11 102.62,74.93 100.58,76.2 92.2,76.2 90.68,74.93 U1.11 82.3,74.93 80.26,76.2 72.64,76.2 69.69,73.44 | U2.34 36.32,77.86 36.83,77.36 38.88,77.36 44.83,73.41 v62.93,73.41 69.69,73.44 | 69.69,73.44 69.65,73.41
  Top 0.61: 60.33,129.54 61.59,128.37 61.59,126.62 60.33,125.22 P2.21
  Bottom 0.406: v62.93,73.41 62.93,86.14 61.59,87.43 61.59,93.4 60.33,94.73 P2.21
D1  (via drill 0.6)
  Top 0.254: 72.52,78.73 72.07,78.5 71.91,77.36
  Top 0.305: 68.78,75.39 69.65,75.39 71.91,77.36
  Top 0.406: P1.20 62.87,129.54 | U15.12 143.26,77.47 141.22,78.74 132.84,78.74 131.32,77.47 U14.12 122.94,77.47 120.9,78.74 v116.31,78.74 112.52,78.74 111,77.47 U13.12 102.62,77.47 100.58,78.74 92.2,78.74 90.68,77.47 U1.12 82.3,77.47 80.26,78.73 72.52,78.73 | U2.33 38.86,78.74 44.96,74.8 47.5,74.8 48.26,75.39 68.78,75.39
  Top 0.61: 62.87,129.54 64.14,128.37 64.14,126.62 62.87,125.22 P2.20
  Bottom 0.406: v116.31,78.74 117.73,80.87 117.73,83.64 114.45,95 114.45,107.82 114.05,108.56
  Bottom 0.61: P2.20 62.87,105.54 65.79,108.56 114.05,108.56
D2  (via drill 0.6)
  Top 0.254: 71.75,81.28 70.94,80.89 70.94,78.05 69.65,77.06 68.78,77.06
  Top 0.406: P1.19 65.41,129.54 | U15.13 143.26,80.01 141.22,81.28 132.84,81.28 131.32,80.01 U14.13 122.94,80.01 120.9,81.28 v116.34,81.28 112.52,81.28 111,80.01 U13.13 102.62,80.01 100.58,81.28 92.2,81.28 90.68,80.01 U1.13 82.3,80.01 80.26,81.28 71.75,81.28 | 68.78,77.06 43.46,77.06 U2.32
  Top 0.61: 65.41,129.54 66.67,128.37 66.67,126.62 65.39,125.22 P2.19
  Bottom 0.406: v116.34,81.28 116.34,83.36 113.77,94.92 113.77,107.04 113.41,107.62
  Bottom 0.61: P2.19 65.41,105.42 67.6,107.62 113.41,107.62
D3  (via drill 0.6)
  Top 0.254: 71.97,82.55 70.43,81.17 70.43,78.36 69.65,77.71 68.78,77.72
  Top 0.406: P1.18 67.94,129.54 | U15.15 132.84,82.55 131.32,81.28 122.94,81.28 120.9,82.55 U14.15 112.52,82.55 111,81.28 v106.6,81.28 102.62,81.28 100.58,82.55 U13.15 92.2,82.55 90.68,81.28 82.3,81.28 80.26,82.55 U1.15 71.97,82.55 | U2.31 45.29,77.72 68.78,77.72
  Top 0.61: 67.94,129.54 69.22,128.37 69.22,126.62 67.97,125.22 P2.18
  Bottom 0.406: v106.6,81.28 106.6,85.94 109.86,90.42 109.86,98.55 104.65,102.36 69.81,102.36 67.95,100.52 P2.18
D4  (via drill 0.6)
  Top 0.254: 71.63,80.01 71.45,77.78 69.47,76.07
  Top 0.305: 68.78,76.07 69.47,76.07
  Top 0.406: P1.17 70.48,129.54 | U15.16 132.84,80.01 131.32,78.74 122.94,78.74 120.9,80.01 U14.16 112.52,80.01 111,78.74 v103.67,78.74 102.62,78.74 100.58,80.01 U13.16 92.2,80 90.68,78.74 82.3,78.74 80.26,80.01 U1.16 71.63,80.01 | v46.48,76.07 68.78,76.07
  Top 0.61: 70.48,129.54 71.75,128.37 71.75,126.62 70.48,125.22 P2.17
  Bottom 0.406: U2.30 v46.48,76.07 | P2.17 70.48,99.47 72.56,100.99 101.6,100.99 104.78,98.55 104.78,88.85 103.67,87.74 v103.67,78.74
D5  (via drill 0.6)
  Top 0.305: 72.36,76.89 69.65,74.4
  Top 0.406: P1.16 73.03,129.54 | U15.17 132.84,77.47 131.32,76.2 122.94,76.2 120.9,77.47 U14.17 112.52,77.47 111,76.2 102.62,76.2 100.58,77.47 v99.19,77.47 U13.17 92.2,77.48 90.68,76.2 82.3,76.2 80.26,77.47 U1.17 72.36,76.89 | v49.02,74.4 69.65,74.4
  Top 0.61: 73.03,129.54 74.3,128.37 74.3,126.62 73.03,125.22 P2.16
  Bottom 0.406: U2.29 v49.02,74.4 | v99.19,77.47 99.19,89.28 99.69,90.93 99.69,98.55 98.04,99.62 73.86,99.62 73.03,99.14 P2.16
D6  (via drill 0.6)
  Top 0.406: P1.15 75.56,129.54 | U15.18 132.84,74.93 131.32,73.66 122.94,73.66 120.9,74.93 U14.18 112.52,74.93 111,73.66 102.62,73.66 100.58,74.93 U13.18 92.2,74.94 90.68,73.66 82.3,73.66 80.26,74.93 U1.18 | 73.65,74.94 U1.18 | U1.18 72.36,74.93 69.65,72.42 v51.56,72.42
  Top 0.61: 75.56,129.54 76.83,128.37 76.83,126.62 75.56,125.22 P2.15
  Bottom 0.406: U2.28 v51.56,72.42 | P2.15 75.56,94.41 76.83,93.17 76.83,89.65 75.36,88.7 75.36,85.94 75.87,85.43 75.87,77.14 U1.18
D7  (via drill 0.6)
  Top 0.406: P1.14 78.11,129.54 | U15.19 132.84,72.39 131.32,71.12 122.94,71.12 120.9,72.39 U14.19 112.52,72.39 111,71.12 102.62,71.12 100.58,72.39 U13.19 92.2,72.38 90.68,71.12 82.3,71.12 80.26,72.39 v78.32,72.39 U1.19 72.62,72.39 69.65,70.43 v54.1,70.43
  Top 0.61: 78.11,129.54 79.38,128.37 79.38,126.62 78.09,125.22 P2.14
  Bottom 0.406: U2.27 v54.1,70.43 | P2.14 78.11,94.42 79.38,93.14 79.38,73.46 v78.32,72.39
DAV  (via drill 0.6)
  Top 0.406: P3.6 11.8,59.89 13.46,58.55 13.46,43.62 13.65,43.12 14.41,43.12 v14.48,43.18 | U4.6 54.77,44.83 45.02,44.83 41.91,41.66 19.3,41.66 18.69,40.98 v18.69,38.61
  Bottom 0.406: v14.48,43.18 v18.69,38.61
DIO1
  Top 0.406: P3.1 12.19,79.7 12.19,68.5 17.27,63.41 17.27,55.02 20.18,53.1 27.16,53.1 U3.5
DIO2
  Top 0.406: U3.4 25.36,52.36 19.74,52.36 16.51,54.59 16.51,63.04 11.43,68.11 11.43,74.93 10.48,75.74 P3.2
DIO3
  Top 0.406: U3.3 23.57,51.61 19.25,51.61 15.75,54.01 15.75,62.69 10.67,67.75 10.67,71.37 10.2,71.78 P3.3
DIO4
  Top 0.406: P3.4 9.42,67.82 14.99,62.46 14.99,53.61 18.83,50.93 21.57,50.93 U3.2
DIO5  (via drill 0.6)
  Top 0.406: U3.6 31.79,47.03 20.33,47.03 v16,51.44
  Bottom 0.406: P3.A 13.26,79.7 14.73,78.58 14.73,71.2 15.95,69.98 15.95,51.49 v16,51.44
DIO6  (via drill 0.6)
  Top 0.406: U3.7 33.54,46.27 19.86,46.27 v16.68,48.87
  Bottom 0.406: P3.B 12,75.74 13.97,74.3 13.97,70.87 15.25,69.58 15.25,52.2 14.99,51.8 14.99,50.52 v16.68,48.87
DIO7  (via drill 0.6)
  Top 0.406: U3.8 35.09,45.5 19.47,45.5 v16.61,47.38
  Bottom 0.406: P3.C 12.19,71.78 14.5,69.32 14.5,52.45 14.22,52.08 14.22,49.86 v16.61,47.38
DIO8  (via drill 0.6)
  Top 0.406: U3.9 37.19,44.74 18.73,44.74 v16.23,45.95
  Bottom 0.406: P3.D 11.24,67.82 13.66,65.39 13.66,52.46 13.42,52.22 13.42,48.76 v16.23,45.95
DOT_CLOCK
  Top 0.406: 98.42,129.54 P1.6
  Top 0.61: 98.42,129.54 99.69,128.37 99.69,126.62 98.42,125.22 P2.6
EOI  (via drill 0.6)
  Top 0.406: P3.5 12.19,63.86 14.22,62.23 14.22,45.57 v14.99,44.9 | U4.7 59.94,47.1 58.29,47.1 55.88,44.15 45.47,44.15 42.46,40.89 20.7,40.89 v19.8,40.68
  Bottom 0.406: v19.8,40.68 v14.99,44.9
GND  (via drill 0.6)
  Top 0.305: Q1.E 59.12,41.05
  Top 0.406: U15.27 132.84,52.07 131.32,50.8 122.94,50.8 120.9,52.07 U14.27 112.52,52.07 111,50.8 102.62,50.8 100.58,52.07 U13.27 90.68,52.07 | U15.2 v145.87,52.07 143.26,52.07 141.22,53.34 132.84,53.34 131.32,52.07 U14.2 122.94,52.07 120.9,53.34 112.52,53.34 111,52.07 U13.2 102.62,52.07 100.58,53.34 92.2,53.34 90.68,52.07 | U1.27 U1.2 90.68,52.07
  Top 1.27: 110.88,84.21 111.18,84.45 | 111.15,133.48 P1.A v111.12,125.91 | P1.Z v57.78,125.73 | U5.7 50.8,41.05 59.12,41.05 65.39,41.05 | 80.01,41.05 94.63,41.05 | 94.63,41.05 109.22,41.05 | 109.22,41.05 112.52,41.05 | 112.52,41.05 123.84,41.05 | 123.84,41.05 v138.66,41.05 138.66,39.37 U11.7 | U10.8 123.84,41.05 | U9.7 109.22,41.05 | U8.7 94.63,41.05 | U7.7 80.01,41.05 | U6.7 65.39,39.37 65.39,41.05 | 43.95,49.02 U3.10 | P2.A 111.18,92 | 36.32,66.67 U2.7 | P4.2 35.56,9.8 | 60.85,9.8 58.42,9.8 P4.20 | 60.85,9.8 60.85,12.32 63.63,12.32 63.63,9.79 | 63.63,9.79 66.04,9.8 P4.26 | P4.24 63.63,4.45 63.63,9.79 | P4.22 60.85,4.45 60.85,9.8 | P4.18 55.88,9.8 | P4.16 53.34,9.8 | P4.14 50.8,9.8 | P4.12 48.26,9.8 | P4.10 45.72,9.8 | P4.8 43.18,9.8 | P4.6 40.64,9.8 | P4.4 38.1,9.8 | 65.39,41.05 65.41,41.03 v70.74,41.03 71.46,41.05 80.01,41.05 | C2.2 112.52,41.05
  Top 1.473: 90.56,84.21 101.6,84.21
  Top 1.524: U1.14 90.56,84.21 | 110.88,84.21 U13.14 101.6,84.21 | 118.62,84.45 111.18,84.45 111.18,92 | U4.10 68.83,51.56 44.7,51.56 43.95,49.02 | v57.78,125.73 57.78,105.54 | 57.78,105.54 P2.22 P2.Z | P2.1 P2.A | U15.14 143.26,82.55 141.22,84.33 130.89,84.33 U14.14 118.62,84.45 | 35.56,9.8 38.1,9.8 40.64,9.8 43.18,9.8 45.72,9.8 48.26,9.8 50.8,9.8 53.34,9.8 54.57,9.8 | 54.57,9.8 55.88,9.8 58.42,9.8 | v54.57,11.35 54.57,9.8 | v42.67,67.69 37.47,67.69 36.32,66.67 26.16,66.67 16.51,76.64 C4.2 24.89,89.15 24.89,95.35 27.18,98.04 51.31,98.04 51.31,105.54 57.78,105.54 | 118.62,84.45 118.62,97.38 117.6,98.27 117.6,117.09 111.12,124.59 v111.12,125.91 | P3.12 v11.8,36.12 13.92,33.93 15.23,33.88 C1.1 30.1,22.1 v41.94,22.1
  Bottom 0.406: 42.67,57.91 U3.11
  Bottom 0.61: v42.67,67.69 42.67,57.91
  Bottom 1.27: P3.L 4.48,43.9 | P3.M 4.51,40.13 | P1.Z v57.78,125.73 57.92,125.86 | U5.7 54.99,39.37 54.99,21.06 51.77,18.25 51.77,13.98 v54.57,11.35 | U4.11 U4.10 | v111.12,125.91 P1.A
  Bottom 1.524: P3.E 11.8,63.86 11.8,59.89 | 11.8,59.89 11.8,55.84 | 11.8,55.84 11.8,51.96 | 11.8,51.96 11.8,47.97 | 11.8,47.97 11.8,43.92 | 11.8,43.92 11.8,40.15 | P3.F 11.8,59.89 | P3.H 11.8,55.84 | P3.J 11.8,51.96 | P3.K 11.8,47.97 | 4.48,43.9 11.8,43.92 | 4.51,40.13 11.8,40.15 | U15.14 145.87,82.55 | P2.Z 57.78,100.8 Q2.3 | 145.87,82.55 v145.87,52.07 C3.2 v138.66,41.05 U11.7 | U4.10 v70.74,41.03 | U10.8 123.83,41.47 126.49,44.7 126.49,81.53 U14.14 | P3.12 v11.8,36.12 11.8,40.15 | v111.12,125.91 111.12,119.38 104.14,119.38 93.98,125.73 v57.78,125.73 | U12.7 145.87,82.55 | v41.94,22.1 44.67,22.1 45.72,23.32 45.72,33.15 47.12,34.39 47.12,37.62 48.72,39.37 U5.7
  pour Top: -2.54,-2.54 157.48,-2.54 157.48,139.7 -2.54,139.7
  pour Bottom: -5.08,-5.08 160.02,-5.08 160.02,144.78 -5.08,144.78
I/O2
  Top 0.406: P1.10 88.27,129.54
  Top 0.61: 88.27,129.54 89.53,128.37 89.53,126.62 88.29,125.22 P2.10
IFC
  Top 0.406: P3.9 10.45,48.01 11.18,47.4 11.18,40.39 13.28,38.16 14.53,38.16 15.24,39.04 15.24,40.75 15.75,43.98 40.64,43.98 43.94,47.12 51.03,47.12 51.64,47.33 51.64,48.95 U4.3
N$1  (via drill 0.6)
  Top 0.254: JP2.3 82.93,15.95 69.47,15.95 v68.48,17.27
  Bottom 0.406: U6.6 68.33,33.91 68.33,27.62 69.43,26.18 69.43,18.8 v68.48,17.27
N$2
  Bottom 0.406: JP2.2 87.38,20.99 85.14,23.32 85.14,28.27 85.97,29.18 86.97,29.18 U8.12
N$3
  Bottom 0.406: JP3.2 U8.13
N$4  (via drill 0.6)
  Top 0.406: U10.1 120.05,25.36 118.26,25.36 118.19,25.4 105.59,25.4 v104.23,26.63 | v103.69,35.56 99.8,35.56 98.54,36.83 U8.6
  Bottom 0.406: v103.69,35.56 v104.23,26.63
N$5
  Top 0.406: U6.2 69.2,26.67 70.34,27.94 81.52,27.94 84.87,31.17 84.87,32.17 U8.10
N$6
  Top 0.406: U5.10 44.42,33.02 61.12,33.02 62.42,31.75 U6.4
N$7
  Top 0.406: U5.9 47.03,36.83 48.31,38.1 82.31,38.1 83.55,39.36 U8.8
  Bottom 0.406: U5.9 42.14,36.83 41.02,35.67 41.02,27.69 41.68,26.63 43.14,26.63 U5.13
N$8
  Top 0.406: U9.8 104.03,39.37 105.13,38.27 105.13,34.9 105.77,34.27 U9.5 111.15,33.5 113.16,33.5 113.79,32.87 113.79,29.77 114.34,29.22 U10.13
N$9  (via drill 0.6)
  Top 0.406: v128.85,38.12 137.13,38.12 U11.6 | U8.2 95.91,27.94 v128.85,27.94
  Bottom 0.406: v128.85,38.12 v128.85,27.94
N$10
  Bottom 0.406: JP4.2 102.62,20.07 U9.2
N$11
  Top 0.254: 106.84,16.51 112.95,16.51 114.25,18.21 117.07,18.21 119.14,17.36 121.12,17.12 121.87,16.64 135.89,16.64 136.4,16.78
  Top 0.305: 106.84,16.51 JP4.1
  Top 0.406: U11.1 138.43,18.11 136.4,16.78
  Bottom 0.406: U11.1 133.93,25.54 133.95,41.48 138.66,46.25 138.66,49.53 141.26,52.13 141.26,83.07 139.83,85.27 U12.6
N$13
  Top 0.406: U11.5 134.06,34.29 132.72,35.56 128.76,35.56 126.66,33.53 124.79,33.02 121.65,32.99 118.19,35.56 114.39,35.56 113.69,34.21 111.23,34.23 110.78,36.18 U9.6
  Bottom 0.254: JP3.3 92.46,16 107.19,16 111.23,21.34
  Bottom 0.406: 111.23,21.34 111.23,34.8 U9.6
N$14
  Top 0.406: U7.1 84.43,24.13 85.6,25.4 88.35,25.4 92.27,29.21 U8.3
N$15
  Bottom 0.406: U12.1 127.09,85.9 123.48,83.29 123.51,75.59 121.77,73.38 121.77,46.7 119.27,42.05 117.72,39.4 U10.9
N$16
  Bottom 0.254: 74.7,16.05 75.55,14.86 117.6,14.86 118.2,15.46 118.2,25.4
  Bottom 0.406: U10.14 118.2,25.4 | 74.7,16.05 74.68,19.34 73.64,20.22 73.66,21.84 74.45,22.35 74.45,29.69 U7.11
N$17
  Top 1.27: S1.1 D1.A
  Bottom 1.27: S1.1 D1.A
N$18
  Top 0.406: U5.2 U6.12
N$19
  Top 1.27: S1.2 D2.A
  Bottom 1.27: S1.2 D2.A
N$20
  Top 1.27: S1.3 D3.A
  Bottom 1.27: S1.3 D3.A
N$21
  Top 1.27: S1.4 D4.A
  Bottom 1.27: S1.4 D4.A
N$22
  Top 1.27: S1.5 D5.A
  Bottom 1.27: S1.5 D5.A
N$23
  Top 1.27: S1.6 D6.A
  Bottom 1.27: S1.6 D6.A
N$24
  Top 1.27: S1.7 D7.A
  Bottom 1.27: S1.7 D7.A
N$25  (via drill 0.6)
  Top 0.406: v84.82,60.96 82.3,60.96 80.26,62.23 U1.23
  Bottom 0.305: 83.76,24.49 83.95,24.96 83.95,35.56 85.22,37.71
  Bottom 0.406: JP1.2 79.7,20.08 80.11,20.57 83.13,20.57 83.76,21.11 83.76,24.49 | 85.22,37.71 85.22,38.84 84.31,39.64 84.31,60.45 v84.82,60.96
N$26
  Top 1.27: S1.8 D8.A
  Bottom 1.27: S1.8 D8.A
N$27
  Bottom 0.406: U2.10 43.94,62.45 44.02,62.37 44.9,62.37 48.37,59.22 49.2,58.67 53.25,58.67 54.1,57.42 U4.17
N$28
  Top 0.406: Q2.2 54.61,89.93 57.16,87.14 R6.2
N$29
  Top 0.406: Q2.1 53.34,93.77 D1.C
  Top 1.27: D8.C D7.C D6.C D5.C D4.C D3.C D2.C D1.C
N$30
  Bottom 0.406: U2.11 46.48,62.7 46.63,61.86 49.35,59.54 53.38,59.54 55,58.27 U4.16
N$31  (via drill 0.6)
  Top 1.27: U2.22 RN1.3
  Bottom 0.406: v66.8,69.44 U2.22
N$32
  Top 1.27: U2.23 RN1.4
N$33  (via drill 0.6)
  Top 0.406: U2.20 69.34,61.45 67.91,60.02 55.63,60.02 v54.24,61.05 | v71.4,47.13 72.9,46.63 87.71,46.63 v88.98,46.38
  Bottom 0.254: 69.34,59.74 70.38,58.42 70.38,51.05 70.61,50.29 70.61,49.57 v71.4,47.13
  Bottom 0.406: U2.20 69.34,59.74 | RN1.9 50.29,82.07 50.29,62.64 51.41,62.29 v54.24,61.05
N$34
  Bottom 0.406: U2.16 U4.15
N$35  (via drill 0.6)
  Top 0.406: v124.94,95.94 125.49,95.39 125.49,94.44 126.22,93.7 131.9,93.7 U12.12 | v47.74,85.51 39.79,85.51 U2.35
  Bottom 0.406: v124.94,95.94 125.11,97.18 124.46,98.4 119,98.4 118.57,99.31 118.57,114.1 115.82,116.46
  Bottom 0.61: 115.82,116.46 65.67,116.46 51.45,103.43 51.45,93.47 52.12,91.67 52.12,89.08 v47.74,85.51
N$38
  Top 0.406: U7.2 81.92,26.67 U8.11 U8.4
N$39  (via drill 0.6)
  Top 0.254: 109.73,43.56 111,45.09 114.3,45.09 115.7,43.57
  Top 0.406: U8.5 v98.63,30.49 | v93.51,43.56 109.73,43.56 | 115.7,43.57 120.9,43.57 v122.52,42.55
  Bottom 0.406: U12.2 129.67,85.69 124.98,83.38 124.98,45.44 v122.52,42.55 | JP3.1 98.63,18.95 98.68,24.13 98.98,24.43 98.98,29.95 98.63,30.3 v98.63,30.49 | v93.51,43.56 93.51,40.88 92.53,39.9 92.53,36.37 U8.5
N$40  (via drill 0.6)
  Top 0.406: U5.5 51.88,35.37 54.86,35.37 56.33,36.83 U6.9 62.46,36.83 63.75,35.56 68.59,35.56 v69.9,36.84
  Bottom 0.406: U7.8 71.53,39.37 69.9,37.74 v69.9,36.84
N$41
  Bottom 0.406: U2.17 U4.14
N$42  (via drill 0.6)
  Top 0.406: v57.91,58.81 62.09,58.81 U4.13
  Bottom 0.406: U2.15 58.34,62.56 58.34,59.54 v57.91,58.81 55.8,58.81 53.47,60.3 50.19,60.3 49.02,61.47 U2.12
NDAC  (via drill 0.6)
  Top 0.406: P3.8 10.12,51.97 11.94,50.56 11.94,41.26 12.81,39.98 13.99,39.98 v14.1,39.88 | v16.14,36.27 16.14,41.67 17.65,43.18 41.02,43.18 44.2,46.35 52.59,46.35 53.43,46.83 U4.4
  Bottom 0.406: v14.1,39.88 v16.14,36.27
NRFD  (via drill 0.6)
  Top 0.406: P3.7 11.01,55.93 12.7,54.63 12.7,42.28 13.12,41.47 14.03,41.47 v14.1,41.53 | v17.16,38.61 17.16,41.44 18.14,42.42 41.4,42.42 44.55,45.59 53.34,45.59 U4.5
  Bottom 0.406: v14.1,41.53 v17.16,38.61
PA0  (via drill 0.6)
  Top 0.305: RN2.7 U3.16
  Top 0.406: v28.7,69.6 v45.21,69.6
  Bottom 0.406: P4.3 38.1,13.3 35.97,15.43 35.97,21.88 37.41,23.33 37.41,24.98 35.87,26.53 35.87,41.22 29.97,47.35 29.97,55.24 U3.16 | v45.21,69.6 45.21,87.36 S1.16 | v28.7,69.6 U2.4
  Bottom 1.27: U2.4 RN2.7
PA1  (via drill 0.6)
  Top 0.305: RN2.8 U3.17
  Top 0.406: v34.67,15.75 37.48,15.75 v40.64,11.35 | v26.16,71.88 v42.67,71.88
  Bottom 0.406: v40.64,11.35 P4.5 | v34.67,15.75 34.67,40.04 27.43,47.35 27.43,55.24 U3.17 | v42.67,71.88 42.67,87.39 S1.15 | v26.16,71.88 U2.3
  Bottom 1.27: U2.3 RN2.8
PA2  (via drill 0.6)
  Top 0.305: RN2.9 U3.18
  Top 0.406: v33.6,17.53 38.38,17.53 v43.18,11.35 | v23.62,74.17 v40.13,74.17
  Bottom 0.406: v43.18,11.35 P4.7 | v33.6,17.53 33.6,38.73 24.89,47.35 24.89,55.24 U3.18 | v40.13,74.17 40.13,87.36 S1.14 | v23.62,74.17 U2.2
  Bottom 1.27: U2.2 RN2.9
PA3  (via drill 0.6)
  Top 0.305: RN2.10 U3.19
  Top 0.406: v32.51,18.54 39.38,18.54 v45.72,11.35 | v21.08,76.1 v37.59,76.1
  Bottom 0.406: v45.72,11.35 P4.9 | v32.51,18.54 32.51,36.93 22.35,47.35 22.35,55.24 U3.19 | v37.59,76.1 37.59,87.36 S1.13 | v21.08,76.1 U2.1
  Bottom 1.27: U2.1 RN2.10
PA4  (via drill 0.6)
  Top 0.305: RN2.6 U3.15
  Top 0.406: v21.08,82.04 34.14,82.04 35.43,83.34 35.43,86.98 S1.12
  Bottom 0.406: P4.11 48.26,10.48 46.38,12.36 40.22,12.36 39.8,12.78 39.8,12.79 37.08,15.73 37.08,21.44 38.23,22.58 38.23,25.54 36.96,26.82 36.96,42.84 32.51,47.35 32.51,53.34 33.78,54.61 U3.15 | v21.08,82.04 U2.40 21.08,78.92 29.97,70.03 29.97,61.72 RN2.6
PA5  (via drill 0.6)
  Top 0.305: RN2.5 U3.14
  Top 0.406: v23.62,83.57 32.77,83.57 S1.11
  Bottom 0.406: P4.13 50.8,9.14 46.69,13.26 40.79,13.26 38.23,16.29 38.23,20.93 38.99,22.28 38.99,26.01 37.97,27.19 37.97,44.03 34.92,47.35 34.92,53.34 36.32,54.74 U3.14 | v23.62,83.57 U2.39 23.62,77.6 32.51,68.69 32.51,62.99 33.78,61.72 RN2.5
PA6  (via drill 0.6)
  Top 0.305: RN2.4 U3.13
  Top 0.406: v26.16,85.09 30.48,85.09 S1.10
  Bottom 0.406: P4.15 53.34,7.86 47.13,14.07 41.54,14.07 39.13,16.48 39.13,20.83 39.75,21.5 39.75,26.77 38.86,27.66 38.86,45.83 37.59,47.35 37.59,55.3 U3.13 | v26.16,85.09 U2.38 26.16,76.28 35.05,67.36 35.05,62.99 36.32,61.72 RN2.4
PA7
  Top 0.305: RN2.3 U3.12
  Bottom 0.406: P4.17 55.88,9.12 55.52,9.47 53.17,9.47 47.8,14.85 41.87,14.85 40.01,16.85 40.01,20.54 40.55,21.22 40.55,26.94 39.75,27.94 39.75,46.23 40.13,47.35 40.13,55.31 U3.12 | S1.9 U2.37 28.7,74.98 37.59,65.98 37.59,61.61 RN2.3
PB0  (via drill 0.6)
  Top 0.254: 91.02,46.7 128.1,46.7
  Top 0.406: v57.24,61.98 62.05,62.05 U2.18 | v65.53,47.08 68.07,47.08 71.51,45.97 87.57,45.97 88.48,45.15 89.47,45.15 91.02,46.7 | 128.1,46.7 129.73,45.07 v130.73,42.62
  Bottom 0.254: 129.73,41.02 127.25,38.91 127.25,25.36 126.36,24.11
  Bottom 0.406: U2.18 65.53,62.99 v65.53,47.08 | RN1.7 55.37,82.04 55.37,62.85 v57.24,61.98 | v130.73,42.62 129.73,41.02 | 126.36,24.11 U10.2
PB1  (via drill 0.6)
  Top 0.254: 91.45,46.1 126.95,46.1
  Top 0.406: U2.19 66.8,62.17 65.49,60.86 56.57,60.86 v55.69,61.59 | v68.08,45.72 69.34,45.72 71.06,45.31 87.3,45.31 88.1,44.45 89.93,44.45 91.45,46.1 | 126.95,46.1 128.37,44.62 v129.38,42.62
  Bottom 0.254: 128.37,40.92 126.69,39.06 126.69,27.37 125.84,26.7
  Bottom 0.406: U2.19 68.08,62.98 v68.08,45.72 | RN1.8 52.83,82.04 52.83,70.6 51.33,69.1 51.33,68.36 52.83,66.85 52.83,62.61 v55.69,61.59 | v129.38,42.62 128.37,40.92 | 125.84,26.7 U10.3
PB3  (via drill 0.6)
  Top 0.254: v66.36,16.89 68.17,15.44 89.22,15.44 89.86,16.07 JP2.1
  Top 0.406: v74.65,35.57 70.46,35.57 69.14,34.29 U6.5
  Top 1.27: U2.21 RN1.2
  Bottom 0.254: U2.21 69.86,78.98 69.86,65.91 71.42,64.24 71.42,51.56 71.81,51.07 71.81,49.67 72.12,48.72 73.08,48.15 74.65,46.35
  Bottom 0.406: U6.5 67.64,32.05 67.64,23.37 68.71,21.45 68.71,20.57 v66.36,16.89 | v74.65,35.57 74.65,46.35
PB6
  Top 1.27: U2.24 RN1.5
  Bottom 0.406: U2.24 61.72,67.03 60.45,65.79 60.45,45.44 Q1.B
PB7
  Top 0.406: R6.1 71.98,85.47 57.91,85.64 RN1.6
  Top 1.27: U2.25 RN1.6
PD/!PGM1  (via drill 0.6)
  Top 0.406: v82.51,21.74 83.71,21.92 86.78,21.92 87.78,22.67 96.46,22.63 97.14,22.84 102.69,22.84 107.68,21.14 113.91,20.41 119.62,20.38 121.54,20.17 v129.34,20.17 | U1.22 v78.32,64.77
  Bottom 0.406: U7.3 81.79,29.21 81.81,29.16 | U11.13 128.64,24.5 v129.34,20.17 | 81.81,29.16 81.92,28.82 81.92,22.29 v82.51,21.74 | 81.81,29.16 82.6,30.92 82.6,37.12 81.99,38.08 81.99,45.72 79.02,48.74 79.02,50.94 78.32,51.6 v78.32,64.77
PD/!PGM2  (via drill 0.6)
  Top 0.254: v104.6,44.63 106.17,45.59 124.04,45.59 v128,42.62
  Top 0.406: U13.22 100.58,64.77 102.62,63.58 v104.6,63.58 | U10.6 125.86,34.29 128.41,36.84 U11.9
  Bottom 0.254: 127,40.64 126.11,39.38 126.11,36.21 U10.6
  Bottom 0.406: v104.6,63.58 v104.6,44.63 | v128,42.62 127,40.64
PD/!PGM3  (via drill 0.6)
  Top 0.406: U14.22 120.9,64.77 122.94,63.61 v123.22,63.61 | U10.5 U11.10
  Bottom 0.406: v123.22,63.61 123.22,46.61 120.36,40.62 120.36,32.7 121.32,31.74 123.81,31.74 U10.5
PD/!PGM4  (via drill 0.6)
  Top 0.406: U10.4 U11.12 132.09,30.48 v141.22,30.48 | v147.59,63.5 143.26,63.5 141.22,64.77 U15.22
  Bottom 0.406: v147.59,63.5 147.59,50.8 v141.22,30.48
PHASE2  (via drill 0.6)
  Top 0.406: 99.69,113.37 99.24,112.43 99.24,103.12 99.69,102.5 | U8.9 89.04,36.83 90.26,35.56 98.17,35.56 99.49,34.29 U9.10
  Top 0.61: v100.97,127.58 100.97,126.62 99.69,125.22 99.69,113.37 | 99.69,102.5 99.69,93.17 P2.E
  Bottom 0.406: U9.10 99.57,35.81 99.57,55.37 100.05,57.37 100.05,60.5 99,62.15 99,75.56 100.43,77 100.43,89.28 100.97,90.55 P2.E
  Bottom 1.27: P1.E v100.97,127.58
R/!W  (via drill 0.6)
  Top 0.406: P1.5 100.97,129.54 | P2.5 | 100.97,113.07 100.06,111.94 100.05,103.8 100.97,102.7 | U5.12 44.45,30.49 63.37,30.49 64.67,29.21 U6.3 66.69,30.48 82.39,30.48 83.93,32.04 83.93,34.8 85.34,38.1 100.43,38.1 U9.9
  Top 0.61: 100.97,129.54 102.23,128.37 102.23,126.62 100.97,125.22 100.97,113.07 | 100.97,102.7 P2.5 100.97,94.56 102.23,93.28 102.23,90.68 v103.5,89.41
  Bottom 0.406: U9.9 102.96,36.83 104.01,37.88 104.01,40.72 103.09,41.64 103.09,58.38 103.76,58.83 103.76,60.12 102.16,61.49 102.16,88.06 v103.5,89.41
STROBE  (via drill 0.6)
  Top 0.406: v58.57,16.37 53.49,16.62 52.6,15.73 42.98,15.73 41.31,17.4 v41.31,19.56 v30.86,19.56 | R2.2 v60.71,16.1
  Bottom 0.305: 60.22,19.38 60.15,16.9
  Bottom 0.406: v58.57,16.37 v60.71,16.1 60.15,16.9 | Q1.C 64.2,42.69 61.25,40.64 61.25,27.14 61.56,26.84 61.56,23.32 61.16,22.82 60.22,19.38 | v30.86,19.56 30.86,18.02 35.56,13.45 v35.56,12.12
  Bottom 1.27: v35.56,12.12 P4.1
TE  (via drill 0.6)
  Top 0.406: v46.47,42.42 v56.24,42.44 | v25.65,33.71 39.95,33.71 41.82,35.57 45.43,35.57 v45.44,35.56 | v47.07,58.84 50.77,58.98 51.91,60.11 51.91,61.2 U2.13
  Bottom 0.406: v45.44,35.56 45.44,41.15 v46.47,42.42 U4.1 | v47.07,58.84 47.74,58.05 47.74,55.3 48.28,54.75 50.86,54.75 55.38,50.23 55.38,43.27 v56.24,42.44 | U3.1 21.08,46.88 25.65,41.55 v25.65,33.71
VCC  (via drill 0.6)
  Top 0.254: JP1.3 75.09,16.48 71.35,16.48 70.51,16.59
  Top 0.406: U15.1 143.26,49.53 141.22,50.8 132.84,50.8 131.32,49.53 U14.1 122.94,49.53 120.9,50.8 112.52,50.8 111,49.53 109.41,49.53 | U15.26 132.84,54.61 131.32,53.34 122.94,53.34 120.9,54.61 U14.26 112.52,54.61 111,53.34 102.62,53.34 100.58,54.61 U13.26 92.2,54.56 90.68,53.34 82.37,53.34 77.8,54.61 U1.26 | 50.28,60.41 50.29,60.41 | 45.21,66.55 47.75,66.55 | U13.1 102.62,49.53 100.58,50.8 92.2,50.8 90.68,49.53 U1.1 | R3.1 65.9,18.82 69.09,18.54 70.51,16.59
  Top 0.686: 50.29,60.41 50.29,66.55 | 47.75,66.55 47.75,60.31 | 45.21,66.55 45.21,60.43
  Top 0.711: v125.84,25.4 121.82,25.4
  Top 1.143: 85.88,23.09 81.94,23.09 81.33,22.55
  Top 1.219: 66.94,22.59 v63.51,22.58
  Top 1.27: P1.3 106.05,127.42 107.38,127.42 | 107.38,127.42 108.58,127.42 P1.2 | C1.2 U5.14 44.95,22.36 57.86,22.36 | U6.14 57.86,24.13 57.86,22.36 | U7.14 72.38,24.13 | U8.14 | U9.14 101.62,24.13 | U10.16 116.31,21.59 | 75.37,47.82 93.9,47.82 | 93.9,47.82 114.43,47.82 | 114.43,47.82 134.68,47.82 | U13.28 93.9,49.53 93.9,47.82 | U13.1 109.41,49.53 | U14.28 114.43,49.53 114.43,47.82 | U15.28 134.68,49.53 | 107.52,127.28 107.38,127.42 | 46.47,54.28 21.72,54.28 U3.20 | U4.20 | v56.64,66.55 50.29,66.55 45.21,66.55 | 50.28,60.45 50.28,60.41 | U10.16 v119.19,21.59 v120.32,23.55 | v63.51,22.58 57.86,22.36 | U9.14 103.91,24 107.9,22.5 U10.16 | U9.14 101.45,23.98 95.82,23.98 95.67,24.13 U8.1 94.4,23.91 88.09,23.91 87.87,24.13 U8.14 | U8.14 85.88,23.09 | 81.33,22.55 78.58,22.55 76.99,24.14 U7.14 | U7.14 68.48,24.13 66.94,22.59
  Top 1.397: U1.28 75.37,47.82
  Top 1.524: U15.1 149.85,47.82 | 149.85,47.82 C3.1 | 149.85,47.82 134.68,47.82 134.68,49.53 | 115.06,102.59 115.06,116.73 107.52,125.48 107.52,127.28 | U1.26 72.47,53.9 47.51,53.9 46.47,54.28 U4.20 | U4.20 RN2.1 50.28,60.45 | P2.3 P2.2 108.58,101.36 109.82,102.59 115.06,102.59 | C4.1 v22.36,66.29 | U11.14 v125.84,25.4 | 121.82,25.4 v120.57,26.72 | v116.84,91.87 115.06,102.59
  Bottom 0.254: U1.26 71.96,56.31 71.96,64.52 70.43,66.09 70.43,82.22 RN1.1
  Bottom 0.406: v22.36,66.29 22.35,57.92 U3.20 | JP4.3 U9.14 | U6.14 R1.2 R2.1 | v63.51,22.58 R3.1 | R5.1 R4.2 v119.19,21.59
  Bottom 1.27: U1.28 74.51,49.53 | v56.64,66.55 U2.26 | 117.94,49.7 117.94,49.57
  Bottom 1.524: U12.14 124.62,89.95 118.24,87.9 | U14.28 117.94,49.57 | 74.51,49.53 76.2,50.76 76.2,53.47 U1.26 | v116.84,91.87 118.24,87.9 | 118.24,87.9 119.51,84.14 119.51,77.31 117.94,75.64 117.94,49.7 114.71,42.76 112.52,40.36 C2.1 112.52,32.55 113.84,31.41 113.84,22.86 U10.16 | v120.57,26.72 v120.32,23.55

## Text on the board
tNames: BusCard (TM) | Batteries Included Ltd. | Reverse-engineered by: | P. David Buchan (2017)